# EAGLE schematic freq (EAGLE 5.06)
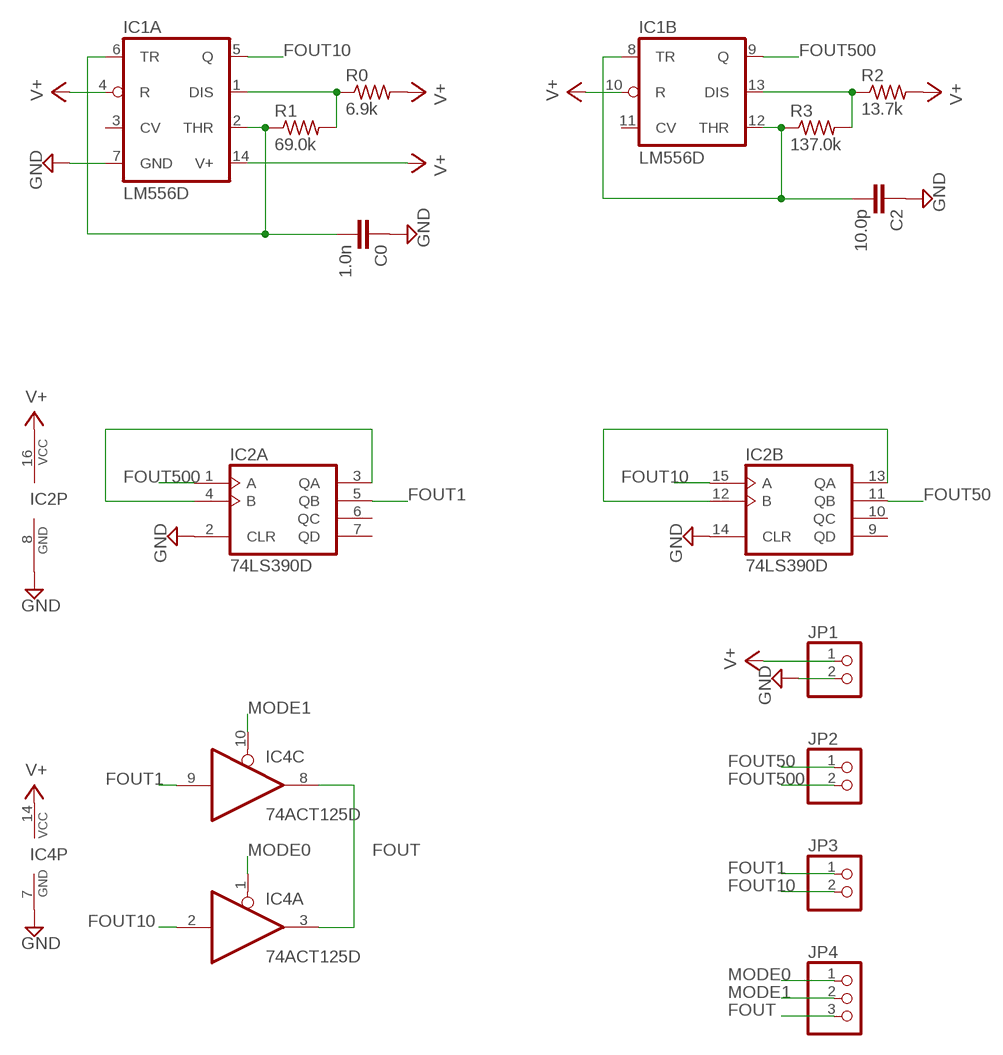
[diagram p0: schematic, sheet 1]

## Parts
C0  1.0n  C-EUC1206  [C1206]
C2  10.0p  C-EUC1206  [C1206]
IC1  LM556D  [SO14]
IC2  74LS390D  [SO16]
IC4  74ACT125D  [SO14]
JP1  PINHD-1X2  [1X02]
JP2  PINHD-1X2  [1X02]
JP3  PINHD-1X2  [1X02]
JP4  PINHD-1X3  [1X03]
R0  6.9k  R-US_R1206  [R1206]
R1  69.0k  R-US_R1206  [R1206]
R2  13.7k  R-US_R1206  [R1206]
R3  137.0k  R-US_R1206  [R1206]

## Nets
FOUT: IC4.3(A:O) IC4.8(C:O) JP4.3
FOUT1: IC2.5(A:QB) IC4.9(C:I) JP3.1
FOUT10: IC1.5(A:Q) IC2.15(B:A) IC4.2(A:I) JP3.2
FOUT50: IC2.11(B:QB) JP2.1
FOUT500: IC1.9(B:Q) IC2.1(A:A) JP2.2
GND: C0.1 C2.1 IC1.7(A:GND) IC2.2(A:CLR) IC2.8(P:GND) IC2.14(B:CLR) IC4.7(P:GND) JP1.2
MODE0: IC4.1(A:OE) JP4.1
MODE1: IC4.10(C:OE) JP4.2
N$4: IC1.1(A:DIS) R0.1 R1.2
N$8: IC1.13(B:DIS) R2.1 R3.2
N$9: C2.2 IC1.8(B:TR) IC1.12(B:THR) R3.1
N$10: C0.2 IC1.2(A:THR) IC1.6(A:TR) R1.1
N$11: IC2.3(A:QA) IC2.4(A:B)
N$12: IC2.12(B:B) IC2.13(B:QA)
V+: IC1.4(A:R) IC1.10(B:R) IC1.14(A:V+) IC2.16(P:VCC) IC4.14(P:VCC) JP1.1 R0.2 R2.2
Unconnected: IC1.3(A:CV) IC1.11(B:CV) IC2.6(A:QC) IC2.7(A:QD) IC2.9(B:QD) IC2.10(B:QC) IC4.4(B:OE) IC4.5(B:I) IC4.6(B:O) IC4.11(D:O) IC4.12(D:I) IC4.13(D:OE)

## Library data of the parts
C0 C2 = resistor:C-EU: CAPACITOR, European symbol
IC1 = linear:*556: Dual TIMER
IC2 = 74xx-us:74*390: Dual 4-bit decade and binary COUNTER
IC4 = 74xx-eu:74*125: Quad bus BUFFER, 3-state
JP1-JP3 = pinhead:PINHD-1X2: PIN HEADER
JP4 = pinhead:PINHD-1X3: PIN HEADER
R0 R1-R3 = rcl:R-US_: RESISTOR, American symbol